# EAGLE design Modular_RFPA_v101 (EAGLE 6.6.0)

## Sheet 1 of 4
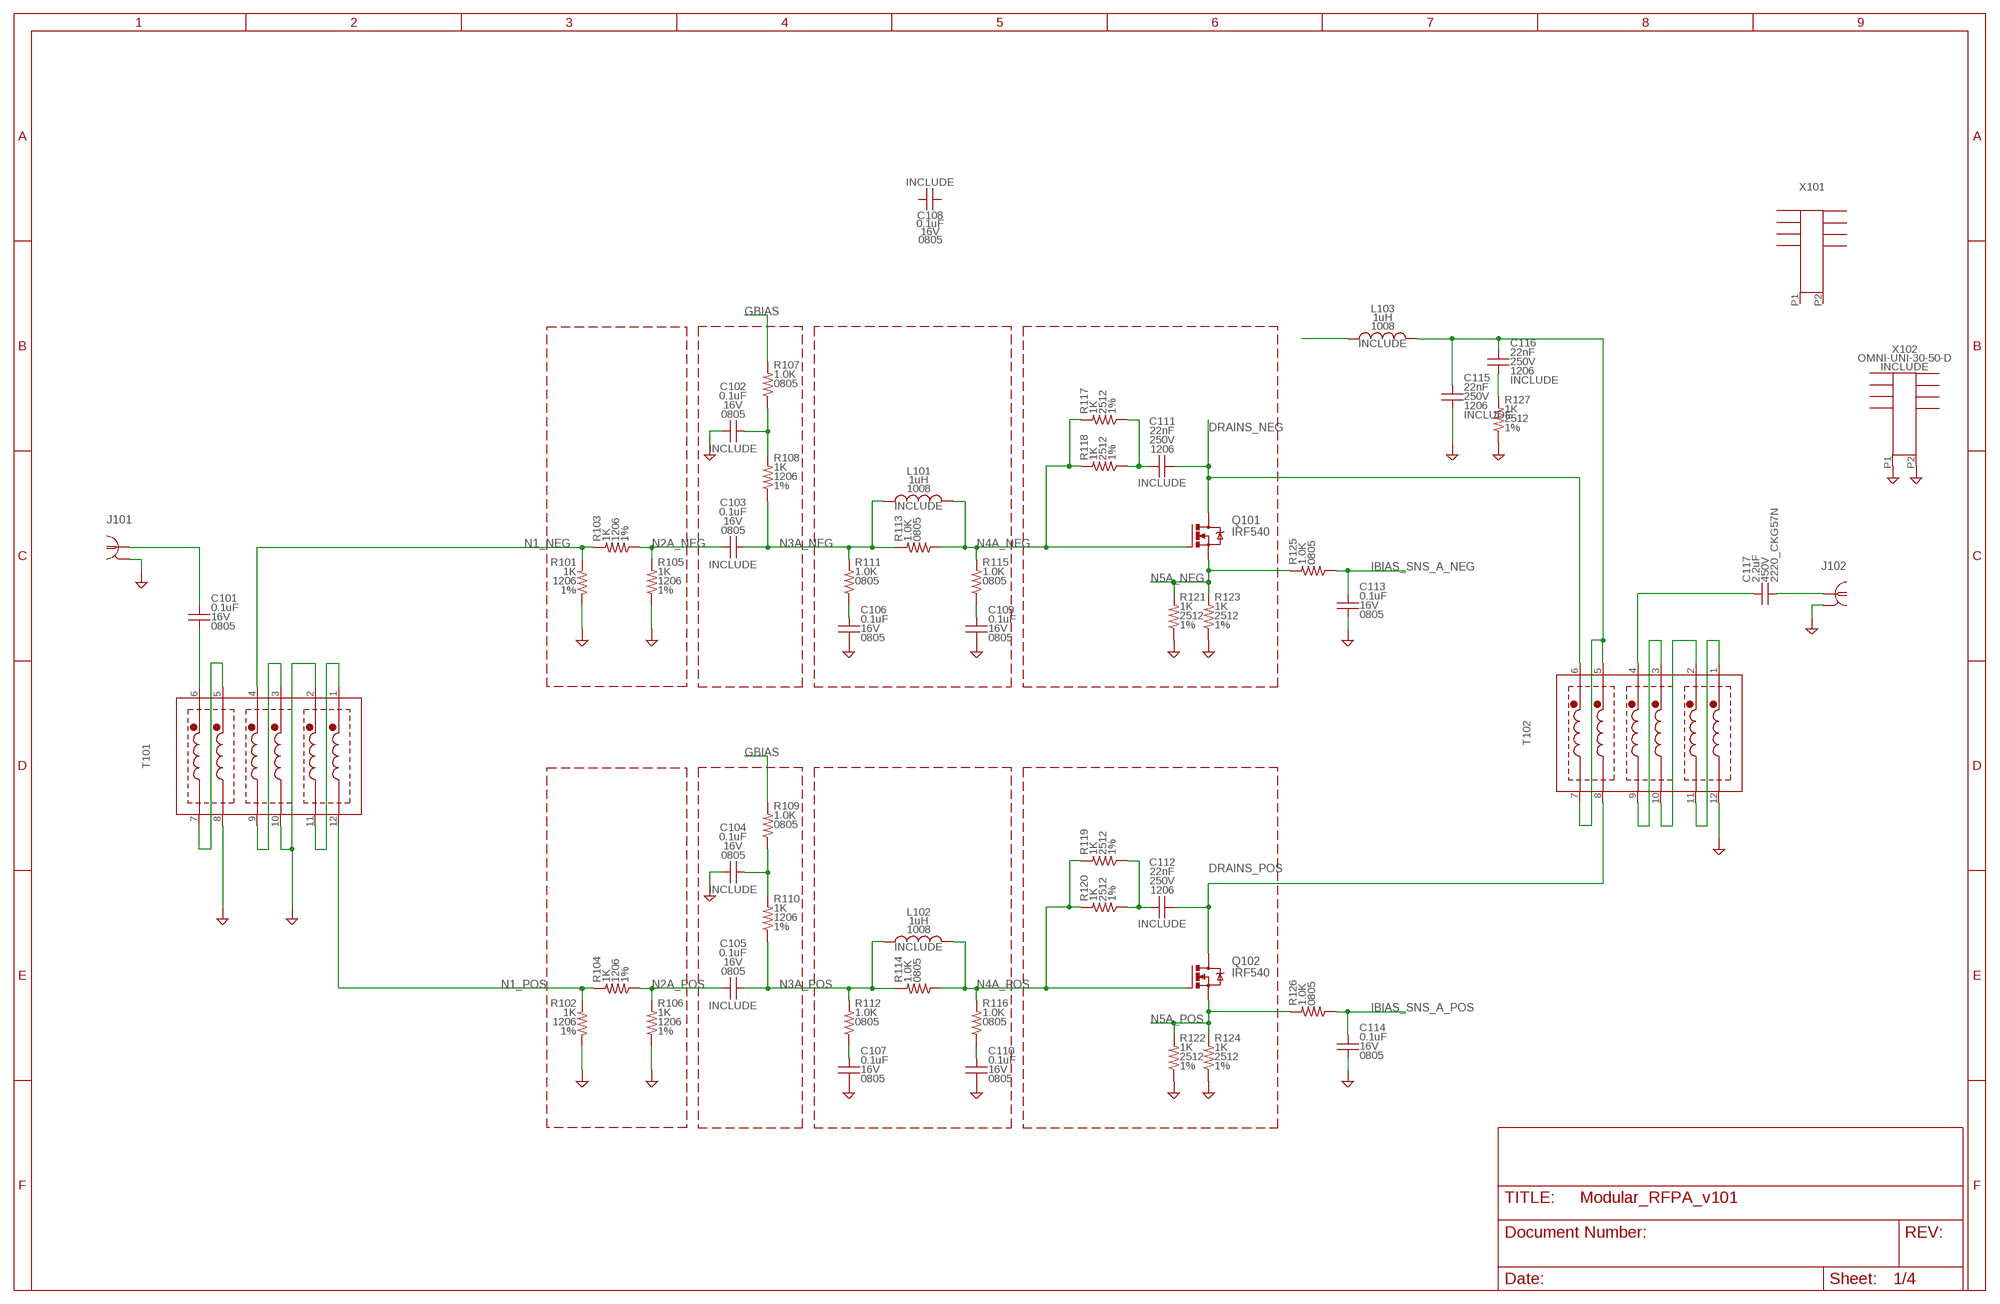
[diagram p0: schematic, sheet 1]

### Parts
C101  0.1uF  CC-0.1U-16V-0805-X7R0805_IPC  [0805_IPC-7351B]
C102  0.1uF  CC-0.1U-16V-0805-X7R0805_IPC  [0805_IPC-7351B]
C103  0.1uF  CC-0.1U-16V-0805-X7R0805_IPC  [0805_IPC-7351B]
C104  0.1uF  CC-0.1U-16V-0805-X7R0805_IPC  [0805_IPC-7351B]
C105  0.1uF  CC-0.1U-16V-0805-X7R0805_IPC  [0805_IPC-7351B]
C106  0.1uF  CC-0.1U-16V-0805-X7R0805_IPC  [0805_IPC-7351B]
C107  0.1uF  CC-0.1U-16V-0805-X7R0805_IPC  [0805_IPC-7351B]
C108  0.1uF  CC-0.1U-16V-0805-X7R0805_IPC  [0805_IPC-7351B]
C109  0.1uF  CC-0.1U-16V-0805-X7R0805_IPC  [0805_IPC-7351B]
C110  0.1uF  CC-0.1U-16V-0805-X7R0805_IPC  [0805_IPC-7351B]
C111  22nF  CC-22N-250V-5%-1206-NP0C1206  [C1206]
C112  22nF  CC-22N-250V-5%-1206-NP0C1206  [C1206]
C113  0.1uF  CC-0.1U-16V-0805-X7R0805_IPC  [0805_IPC-7351B]
C114  0.1uF  CC-0.1U-16V-0805-X7R0805_IPC  [0805_IPC-7351B]
C115  22nF  CC-22N-250V-5%-1206-NP0C1206  [C1206]
C116  22nF  CC-22N-250V-5%-1206-NP0C1206  [C1206]
C117  2.2uF  CC-2.2U-450V-20%-2220-X7TC2220_CKG57N  [C2220_CKG57N]
J101  COAXBNC_EDGE  [BNC_EDGE]
J102  COAXBNC_EDGE  [BNC_EDGE]
L101  1uH  L_CHIPL-1.0U-AIR-5%-1008-0.37A1008  [L1008]
L102  1uH  L_CHIPL-1.0U-AIR-5%-1008-0.37A1008  [L1008]
L103  1uH  L_CHIPL-1.0U-AIR-5%-1008-0.37A1008  [L1008]
Q101  IRF540  [TO220BV]
Q102  IRF540  [TO220BV]
R101  1K  RR-1.0K-1%-1206-0.25WR1206  [R1206]
R102  1K  RR-1.0K-1%-1206-0.25WR1206  [R1206]
R103  1K  RR-1.0K-1%-1206-0.25WR1206  [R1206]
R104  1K  RR-1.0K-1%-1206-0.25WR1206  [R1206]
R105  1K  RR-1.0K-1%-1206-0.25WR1206  [R1206]
R106  1K  RR-1.0K-1%-1206-0.25WR1206  [R1206]
R107  1.0K  RR-1.0K-0.1%-0805-0.1W0805_IPC  [0805_IPC-7351B]
R108  1K  RR-1.0K-1%-1206-0.25WR1206  [R1206]
R109  1.0K  RR-1.0K-0.1%-0805-0.1W0805_IPC  [0805_IPC-7351B]
R110  1K  RR-1.0K-1%-1206-0.25WR1206  [R1206]
R111  1.0K  RR-1.0K-0.1%-0805-0.1W0805_IPC  [0805_IPC-7351B]
R112  1.0K  RR-1.0K-0.1%-0805-0.1W0805_IPC  [0805_IPC-7351B]
R113  1.0K  RR-1.0K-0.1%-0805-0.1W0805_IPC  [0805_IPC-7351B]
R114  1.0K  RR-1.0K-0.1%-0805-0.1W0805_IPC  [0805_IPC-7351B]
R115  1.0K  RR-1.0K-0.1%-0805-0.1W0805_IPC  [0805_IPC-7351B]
R116  1.0K  RR-1.0K-0.1%-0805-0.1W0805_IPC  [0805_IPC-7351B]
R117  1K  RR-1K-1%-2512-1WR2512  [R2512]
R118  1K  RR-1K-1%-2512-1WR2512  [R2512]
R119  1K  RR-1K-1%-2512-1WR2512  [R2512]
R120  1K  RR-1K-1%-2512-1WR2512  [R2512]
R121  1K  RR-1K-1%-2512-1WR2512  [R2512]
R122  1K  RR-1K-1%-2512-1WR2512  [R2512]
R123  1K  RR-1K-1%-2512-1WR2512  [R2512]
R124  1K  RR-1K-1%-2512-1WR2512  [R2512]
R125  1.0K  RR-1.0K-0.1%-0805-0.1W0805_IPC  [0805_IPC-7351B]
R126  1.0K  RR-1.0K-0.1%-0805-0.1W0805_IPC  [0805_IPC-7351B]
R127  1K  RR-1K-1%-2512-1WR2512  [R2512]
T101  HP5_TRAFOHP5  [HP5]
T102  HP5_TRAFOHP5  [HP5]
X101  HEATSINK_OMNI_DUAL30-75-D  [OMNI-UNI-30-75-D]
X102  HEATSINK_OMNI_DUALOMNI-UNI-30-50-DUNI-30-50-D  [OMNI-UNI-30-50-D]

### Nets
DRAINS_NEG: C111.2 Q101.D T102.6(S6)
DRAINS_POS: C112.2 Q102.D T102.8(F5)
GBIAS: R107.1 R109.1 ; also sheet 3
GND: C102.2 C104.2 C106.2 C107.2 C109.2 C110.2 C113.2 C114.2 C115.2 J101.G1(GND1) J101.G2(GND1) J101.G3(GND1) J101.G4(GND1) J102.G1(GND1) J102.G2(GND1) J102.G3(GND1) J102.G4(GND1) R101.2 R102.2 R105.2 R106.2 R121.2 R122.2 R123.2 R124.2 R127.2 T101.2(S2) T101.8(F5) T101.10(F3) T102.12(F1) X102.P1 X102.P2 ; also sheet 3,4
IBIAS_SNS_A_NEG: C113.1 R125.2
IBIAS_SNS_A_POS: C114.1 R126.2
N1_NEG: R101.1 R103.1 T101.4(S4)
N1_POS: R102.1 R104.1 T101.12(F1)
N2A_NEG: C103.2 R103.2 R105.1
N2A_POS: C105.2 R104.2 R106.1
N3A_NEG: C103.1 L101.1 R108.2 R111.1 R113.1
N3A_POS: C105.1 L102.1 R110.2 R112.1 R114.1
N4A_NEG: L101.2 Q101.G R113.2 R115.1 R117.1 R118.1
N4A_POS: L102.2 Q102.G R114.2 R116.1 R119.1 R120.1
N5A_NEG: Q101.S R121.1 R123.1 R125.1
N5A_POS: Q102.S R122.1 R124.1 R126.1
N$4: C111.1 R117.2 R118.2
N$5: C106.1 R111.2
N$8: C104.1 R109.2 R110.1
N$10: C107.1 R112.2
N$11: C110.1 R116.2
N$12: C112.1 R119.2 R120.2
N$13: C102.1 R107.2 R108.1
N$17: C109.1 R115.2
N$22: L103.1
N$27: T102.3(S3) T102.9(F4)
N$28: T102.2(S2) T102.10(F3)
N$29: T102.1(S1) T102.11(F2)
N$30: T101.3(S3) T101.9(F4)
N$31: C117.2 J102.C
N$32: C117.1 T102.4(S4)
N$33: T101.1(S1) T101.11(F2)
N$34: C101.1 J101.C
N$37: C116.2 R127.1
N$41: C101.2 T101.6(S6)
VB_CT: C115.1 C116.1 L103.2 T102.5(S5) T102.7(F6)
VB_CT1: T101.5(S5) T101.7(F6)
Unconnected: C108.1 C108.2 X101.P1 X101.P2

## Sheet 2 of 4

## Sheet 3 of 4
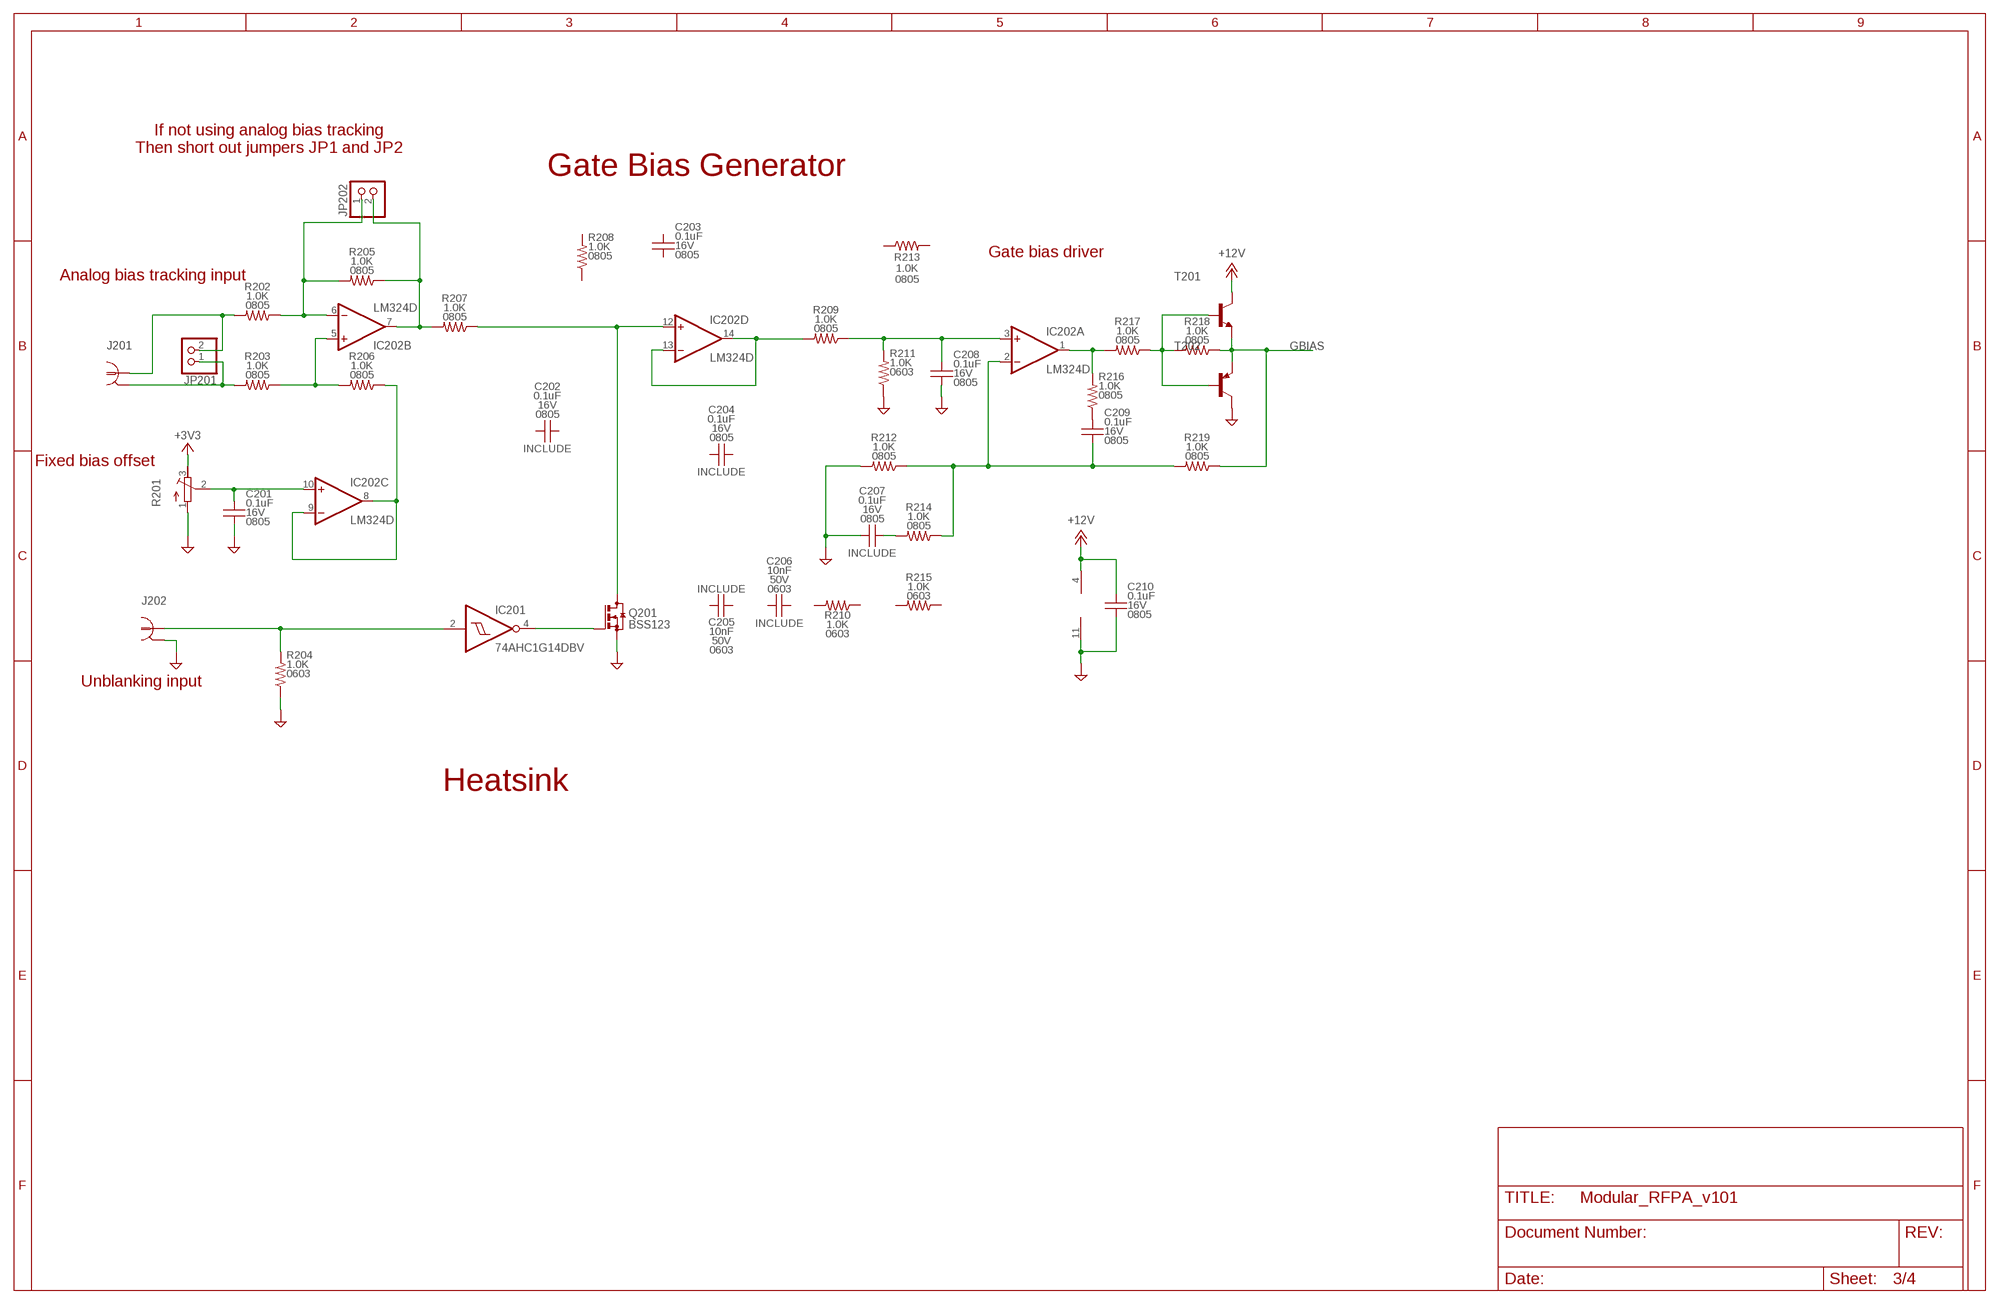
[diagram p1: schematic, sheet 3]

### Parts
C201  0.1uF  CC-0.1U-16V-0805-X7R0805_IPC  [0805_IPC-7351B]
C202  0.1uF  CC-0.1U-16V-0805-X7R0805_IPC  [0805_IPC-7351B]
C203  0.1uF  CC-0.1U-16V-0805-X7R0805_IPC  [0805_IPC-7351B]
C204  0.1uF  CC-0.1U-16V-0805-X7R0805_IPC  [0805_IPC-7351B]
C205  10nF  CC-10N-50V-0603-NP00603_IPC  [0603_IPC-7351B]
C206  10nF  CC-10N-50V-0603-NP00603_IPC  [0603_IPC-7351B]
C207  0.1uF  CC-0.1U-16V-0805-X7R0805_IPC  [0805_IPC-7351B]
C208  0.1uF  CC-0.1U-16V-0805-X7R0805_IPC  [0805_IPC-7351B]
C209  0.1uF  CC-0.1U-16V-0805-X7R0805_IPC  [0805_IPC-7351B]
C210  0.1uF  CC-0.1U-16V-0805-X7R0805_IPC  [0805_IPC-7351B]
IC201  74AHC1G14DBV  [SOT23-5]
IC202  LM324D  [SO14]
J201  COAXBNC_EDGE  [BNC_EDGE]
J202  COAXBNC_EDGE  [BNC_EDGE]
JP201  PINHD-1X2  [1X02]
JP202  PINHD-1X2  [1X02]
Q201  BSS123  [SOT23]
R201  R-TRIMM3299W  [RTRIM3299W]
R202  1.0K  RR-1.0K-0.1%-0805-0.1W0805_IPC  [0805_IPC-7351B]
R203  1.0K  RR-1.0K-0.1%-0805-0.1W0805_IPC  [0805_IPC-7351B]
R204  1.0K  RR-1.0K-0.1%-0603-0.1W0603_IPC  [0603_IPC-7351B]
R205  1.0K  RR-1.0K-0.1%-0805-0.1W0805_IPC  [0805_IPC-7351B]
R206  1.0K  RR-1.0K-0.1%-0805-0.1W0805_IPC  [0805_IPC-7351B]
R207  1.0K  RR-1.0K-0.1%-0805-0.1W0805_IPC  [0805_IPC-7351B]
R208  1.0K  RR-1.0K-0.1%-0805-0.1W0805_IPC  [0805_IPC-7351B]
R209  1.0K  RR-1.0K-0.1%-0805-0.1W0805_IPC  [0805_IPC-7351B]
R210  1.0K  RR-1.0K-0.1%-0603-0.1W0603_IPC  [0603_IPC-7351B]
R211  1.0K  RR-1.0K-0.1%-0603-0.1W0603_IPC  [0603_IPC-7351B]
R212  1.0K  RR-1.0K-0.1%-0805-0.1W0805_IPC  [0805_IPC-7351B]
R213  1.0K  RR-1.0K-0.1%-0805-0.1W0805_IPC  [0805_IPC-7351B]
R214  1.0K  RR-1.0K-0.1%-0805-0.1W0805_IPC  [0805_IPC-7351B]
R215  1.0K  RR-1.0K-0.1%-0603-0.1W0603_IPC  [0603_IPC-7351B]
R216  1.0K  RR-1.0K-0.1%-0805-0.1W0805_IPC  [0805_IPC-7351B]
R217  1.0K  RR-1.0K-0.1%-0805-0.1W0805_IPC  [0805_IPC-7351B]
R218  1.0K  RR-1.0K-0.1%-0805-0.1W0805_IPC  [0805_IPC-7351B]
R219  1.0K  RR-1.0K-0.1%-0805-0.1W0805_IPC  [0805_IPC-7351B]
T201  BC808-NPN-SOT23-BEC  [SOT23-BEC]
T202  BC807-16-PNP-SOT23-BEC  [SOT23-BEC]

### Nets
+3V3: R201.3(E)
+12V: C210.1 IC202.4(P:V+) T201.C ; also sheet 4
GBIAS: R218.2 R219.2 T201.E T202.E ; also sheet 1
GND: C201.2 C207.2 C208.2 C210.2 IC202.11(P:V-) J202.G1(GND1) J202.G2(GND1) J202.G3(GND1) J202.G4(GND1) Q201.2(S) R201.1(A) R204.2 R211.2 R212.1 T202.C ; also sheet 1,4
N$1: IC202.1(A:OUT) R216.1 R217.1
N$2: R217.2 R218.1 T201.B T202.B
N$3: IC201.2(I) J202.C R204.1
N$6: IC202.13(D:-IN) IC202.14(D:OUT) R209.1
N$7: C209.1 R216.2
N$9: C207.1 R214.1
N$14: C209.2 IC202.2(A:-IN) R212.2 R214.2 R219.1
N$15: C208.1 IC202.3(A:+IN) R209.2 R211.1
N$16: IC202.5(B:+IN) R203.2 R206.1
N$18: IC202.7(B:OUT) JP202.2 R205.2 R207.1
N$19: IC202.6(B:-IN) JP202.1 R202.2 R205.1
N$20: J201.C JP201.2 R202.1
N$21: J201.G1(GND1) J201.G2(GND1) J201.G3(GND1) J201.G4(GND1) JP201.1 R203.1
N$23: IC202.12(D:+IN) Q201.3(D) R207.2
N$24: IC201.4(O) Q201.1(G)
N$25: C201.1 IC202.10(C:+IN) R201.2(S)
N$26: IC202.8(C:OUT) IC202.9(C:-IN) R206.2
Unconnected: C202.1 C202.2 C203.1 C203.2 C204.1 C204.2 C205.1 C205.2 C206.1 C206.2 R208.1 R208.2 R210.1 R210.2 R213.1 R213.2 R215.1 R215.2

### Notes on the sheet
- If not using analog bias tracking
  Then short out jumpers JP1 and JP2
- Gate Bias Generator
- Gate bias driver
- Analog bias tracking input
- Fixed bias offset
- Unblanking input
- Heatsink

## Sheet 4 of 4: Power entry
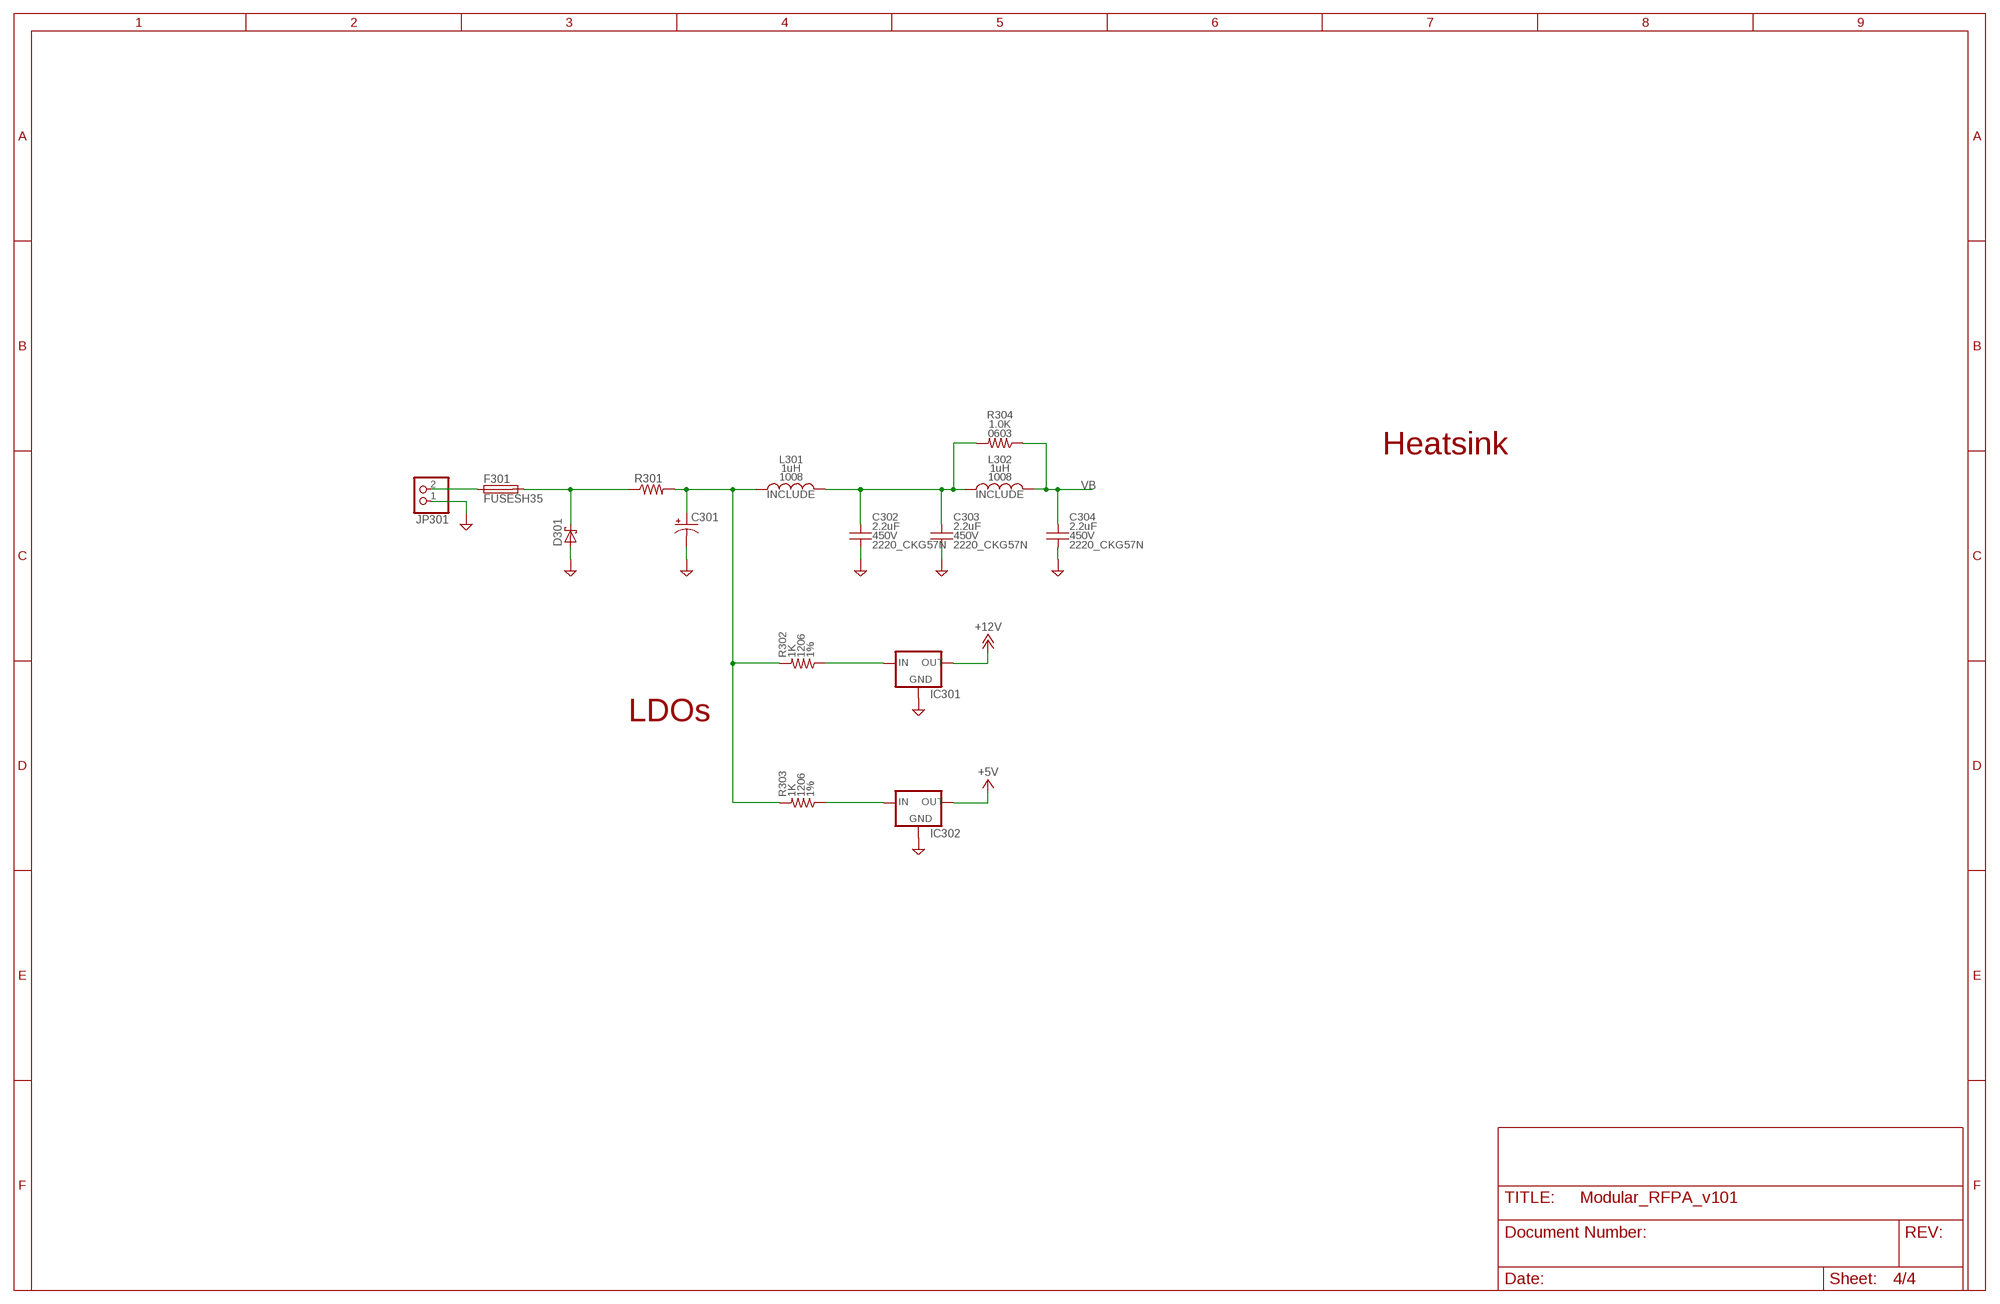
[diagram p2: schematic, sheet 4]

### Parts
C301  CPOL-USE10-25  [EB25D]
C302  2.2uF  CC-2.2U-450V-20%-2220-X7TC2220_CKG57N  [C2220_CKG57N]
C303  2.2uF  CC-2.2U-450V-20%-2220-X7TC2220_CKG57N  [C2220_CKG57N]
C304  2.2uF  CC-2.2U-450V-20%-2220-X7TC2220_CKG57N  [C2220_CKG57N]
D301  SCHOTTKY-DIODESMC  [SMC]
F301  FUSESH35  [SH25]
IC301  78XXS  [78XXS]
IC302  78XXS  [78XXS]
JP301  PINHD-1X2  [1X02]
L301  1uH  L_CHIPL-1.0U-AIR-5%-1008-0.37A1008  [L1008]
L302  1uH  L_CHIPL-1.0U-AIR-5%-1008-0.37A1008  [L1008]
R301  R-US_0617/22  [0617/22]
R302  1K  RR-1.0K-1%-1206-0.25WR1206  [R1206]
R303  1K  RR-1.0K-1%-1206-0.25WR1206  [R1206]
R304  1.0K  RR-1.0K-0.1%-0603-0.1W0603_IPC  [0603_IPC-7351B]

### Nets
+5V: IC302.OUT
+12V: IC301.OUT ; also sheet 3
GND: C301.- C302.2 C303.2 C304.2 D301.A IC301.GND IC302.GND JP301.1 ; also sheet 1,3
N$43: IC301.IN R302.2
N$44: D301.C F301.2 R301.1
N$45: F301.1 JP301.2
N$46: C301.+ L301.1 R301.2 R302.1 R303.1
N$47: C302.1 C303.1 L301.2 L302.1 R304.1
N$49: IC302.IN R303.2
VB: C304.1 L302.2 R304.2

### Notes on the sheet
- Heatsink
- LDOs

## Power pins joined to a net without a drawn wire
GND: IC201.3(GND)
VCC: IC201.5(VCC)

## Library data of the parts
C101 C106 C107 C109 C110 C113 C114 C201 C203 C208-C210 = MDT_C:C; PACKAGE: 0805; VOLTAGE: 16V
C102-C105 C108 C202 C204 C207 = MDT_C:C; BOM: INCLUDE; PACKAGE: 0805; VOLTAGE: 16V
C111 C112 C115 C116 = MDT_C:C; BOM: INCLUDE; DIALECTRIC: NP0; PACKAGE: 1206; PARTNO: C3216NP02E223J160AA; TOL: 5; VOLTAGE: 250V
C117 C302-C304 = MDT_C:C; DIALECTRIC: X7T; PACKAGE: 2220_CKG57N; PARTNO: CKG57NX7T2W225M500JJ; TOL: 20%; VOLTAGE: 450V
C205 C206 = MDT_C:C; BOM: INCLUDE; DIALECTRIC: NP0; PACKAGE: 0603; PARTNO: C1608C0G1H103J080AA; TOL: 5; VOLTAGE: 50V
C301 = rcl:CPOL-US: POLARIZED CAPACITOR, American symbol
D301 = diode:SCHOTTKY-DIODE: Schottky Diode
F301 = fuse:FUSE: Fuse; OC_FARNELL: unknown; OC_NEWARK: unknown
IC201 = 74xx-little-us:74*1G14: Single Schmitt-Trigger Inverter Gate
IC202 = linear:LM324: OP AMP
IC301 IC302 = v-reg:78XXS: VOLTAGE REGULATOR
J101 J102 J201 J202 = MDT_CON:COAX
JP201 JP202 JP301 = pinhead:PINHD-1X2: PIN HEADER
L101-L103 L301 L302 = MDT_L:L_CHIP; BOM: INCLUDE; CORE: AIR; DCR: 1.8; IDC: 0.37A; PACKAGE: 1008; PARTNO: 1008CS-102XJEC; TOL: 5%
Q101 Q102 = transistor-power:IRF540: HEXFET Power MOSFET
Q201 = transistor-small-signal:BSS123: N-CHANNEL MOS FET
R101-R106 R108 R110 R302 R303 = MDT_R:R; PACKAGE: 1206; POWER: 0.25; TOL: 1%
R107 R109 R111-R116 R125 R126 R202 R203 R205-R209 R212-R214 R216-R219 = MDT_R:R; PACKAGE: 0805
R117-R124 R127 = MDT_R:R; PACKAGE: 2512; POWER: 1; TOL: 1%
R201 = rcl:R-TRIMM: Trimm resistor
R204 R210 R211 R215 R304 = MDT_R:R; PACKAGE: 0603
R301 = resistor:R-US_: RESISTOR, American symbol
T101 T102 = MDT_TRAFO:HP5_TRAFO
T201 = transistor:*-NPN-: NPN Transistror BF959 corrected 2008.03.06
T202 = transistor:*-PNP-: PNP Transistror
X101 = MDT_HEATSINK:HEATSINK_OMNI_DUAL
X102 = MDT_HEATSINK:HEATSINK_OMNI_DUAL; BOM: INCLUDE; PARTNO: OMNI-UNI-30-50-D

## Board
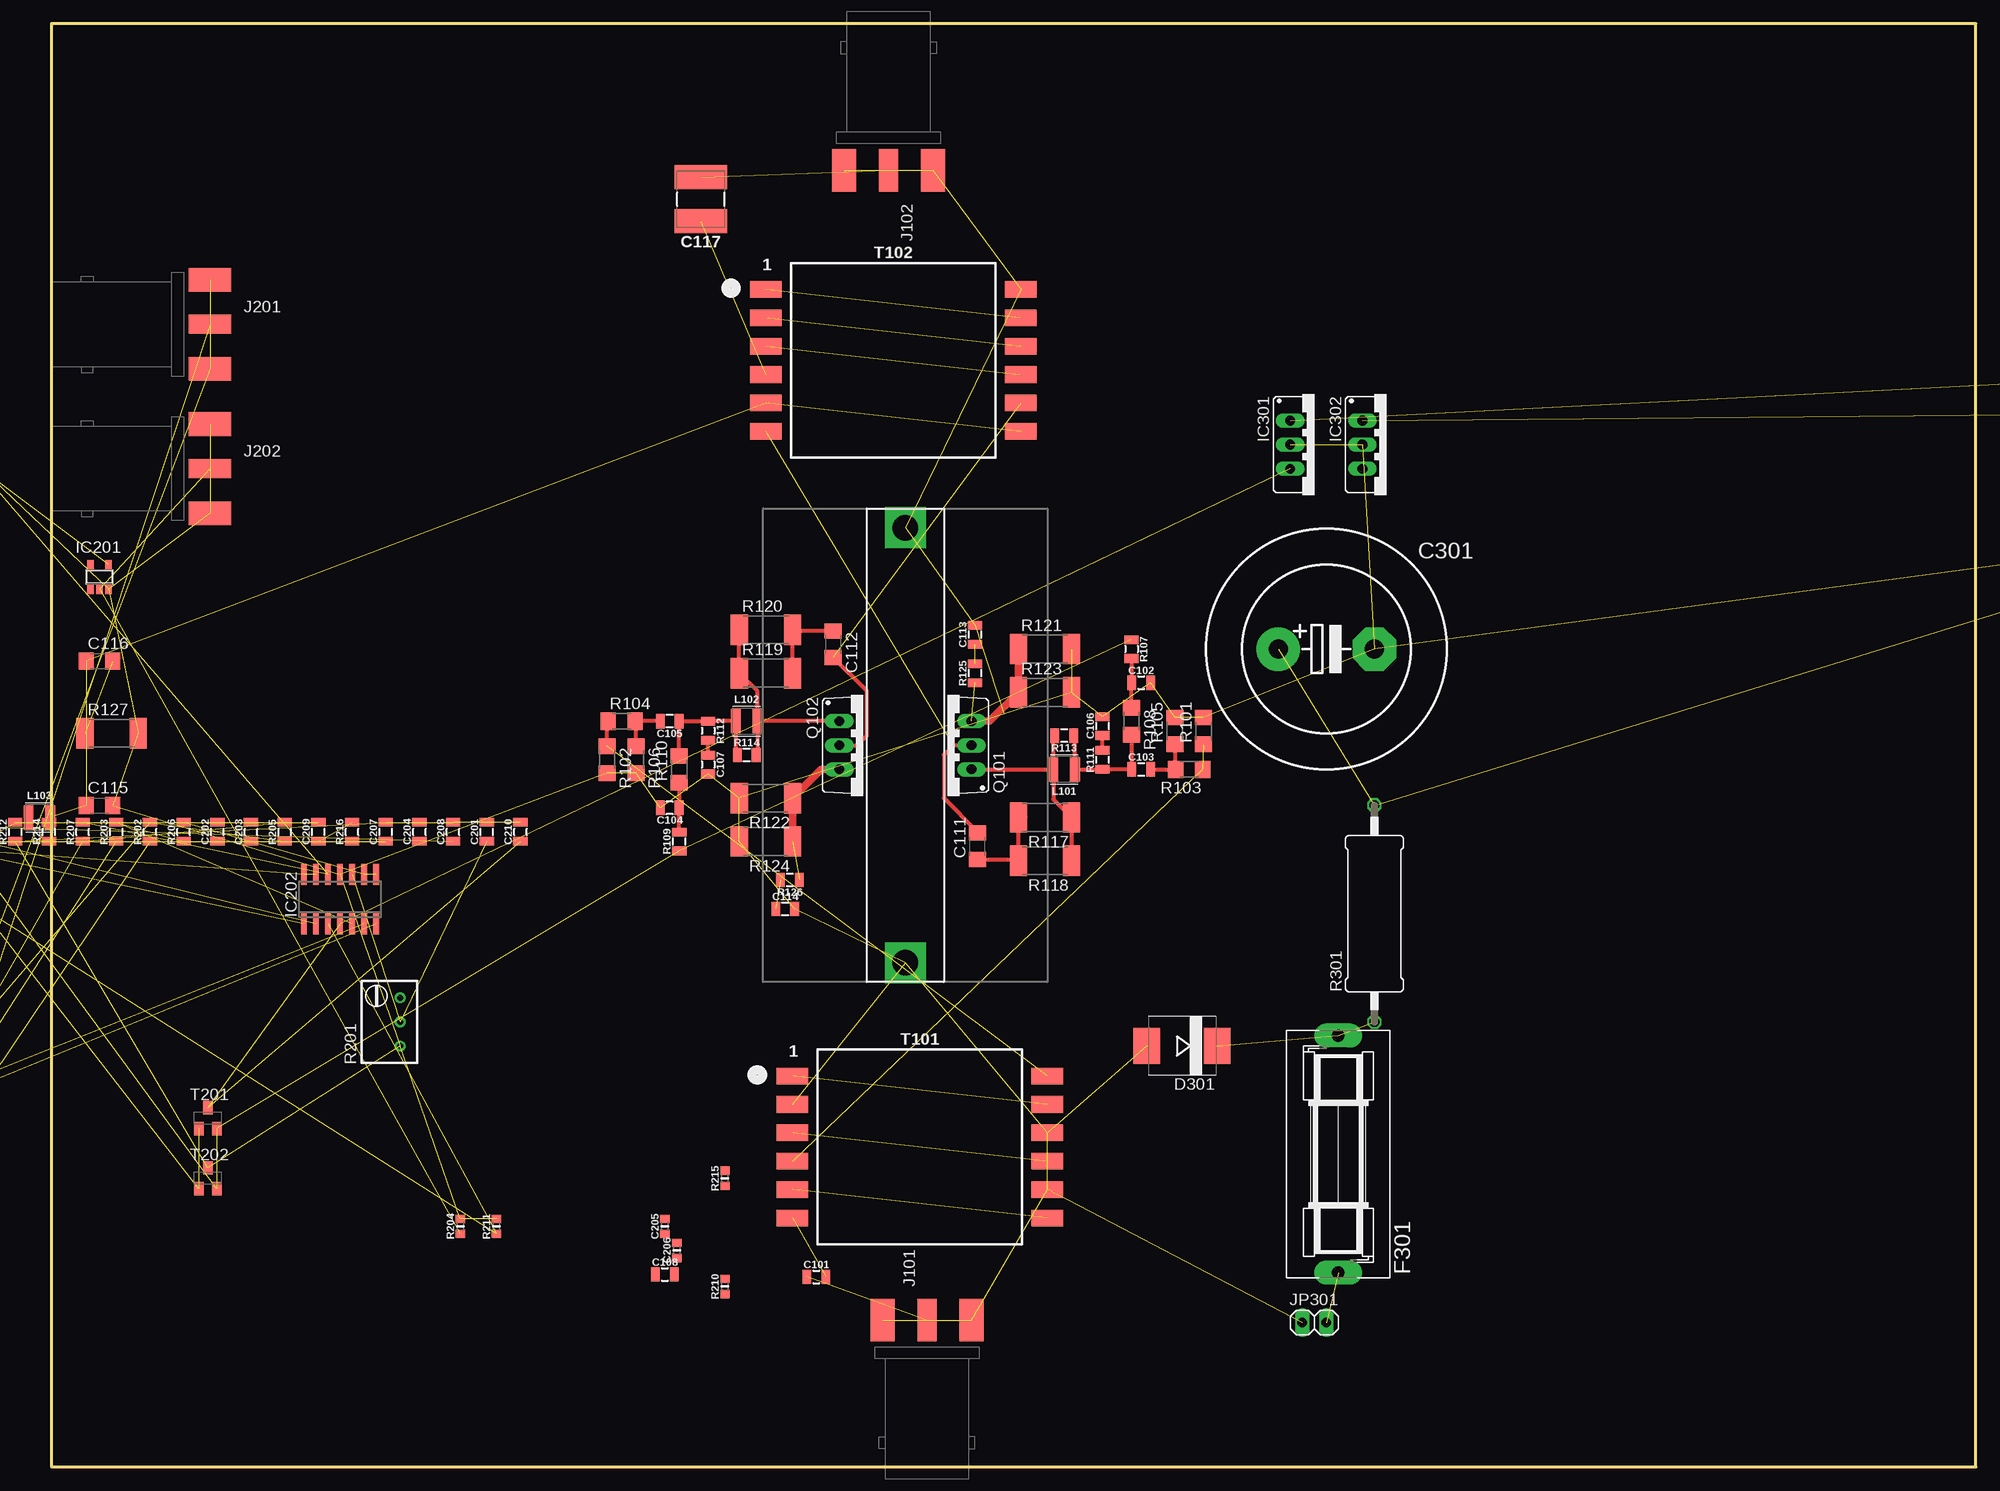
[diagram p3: board, top side]
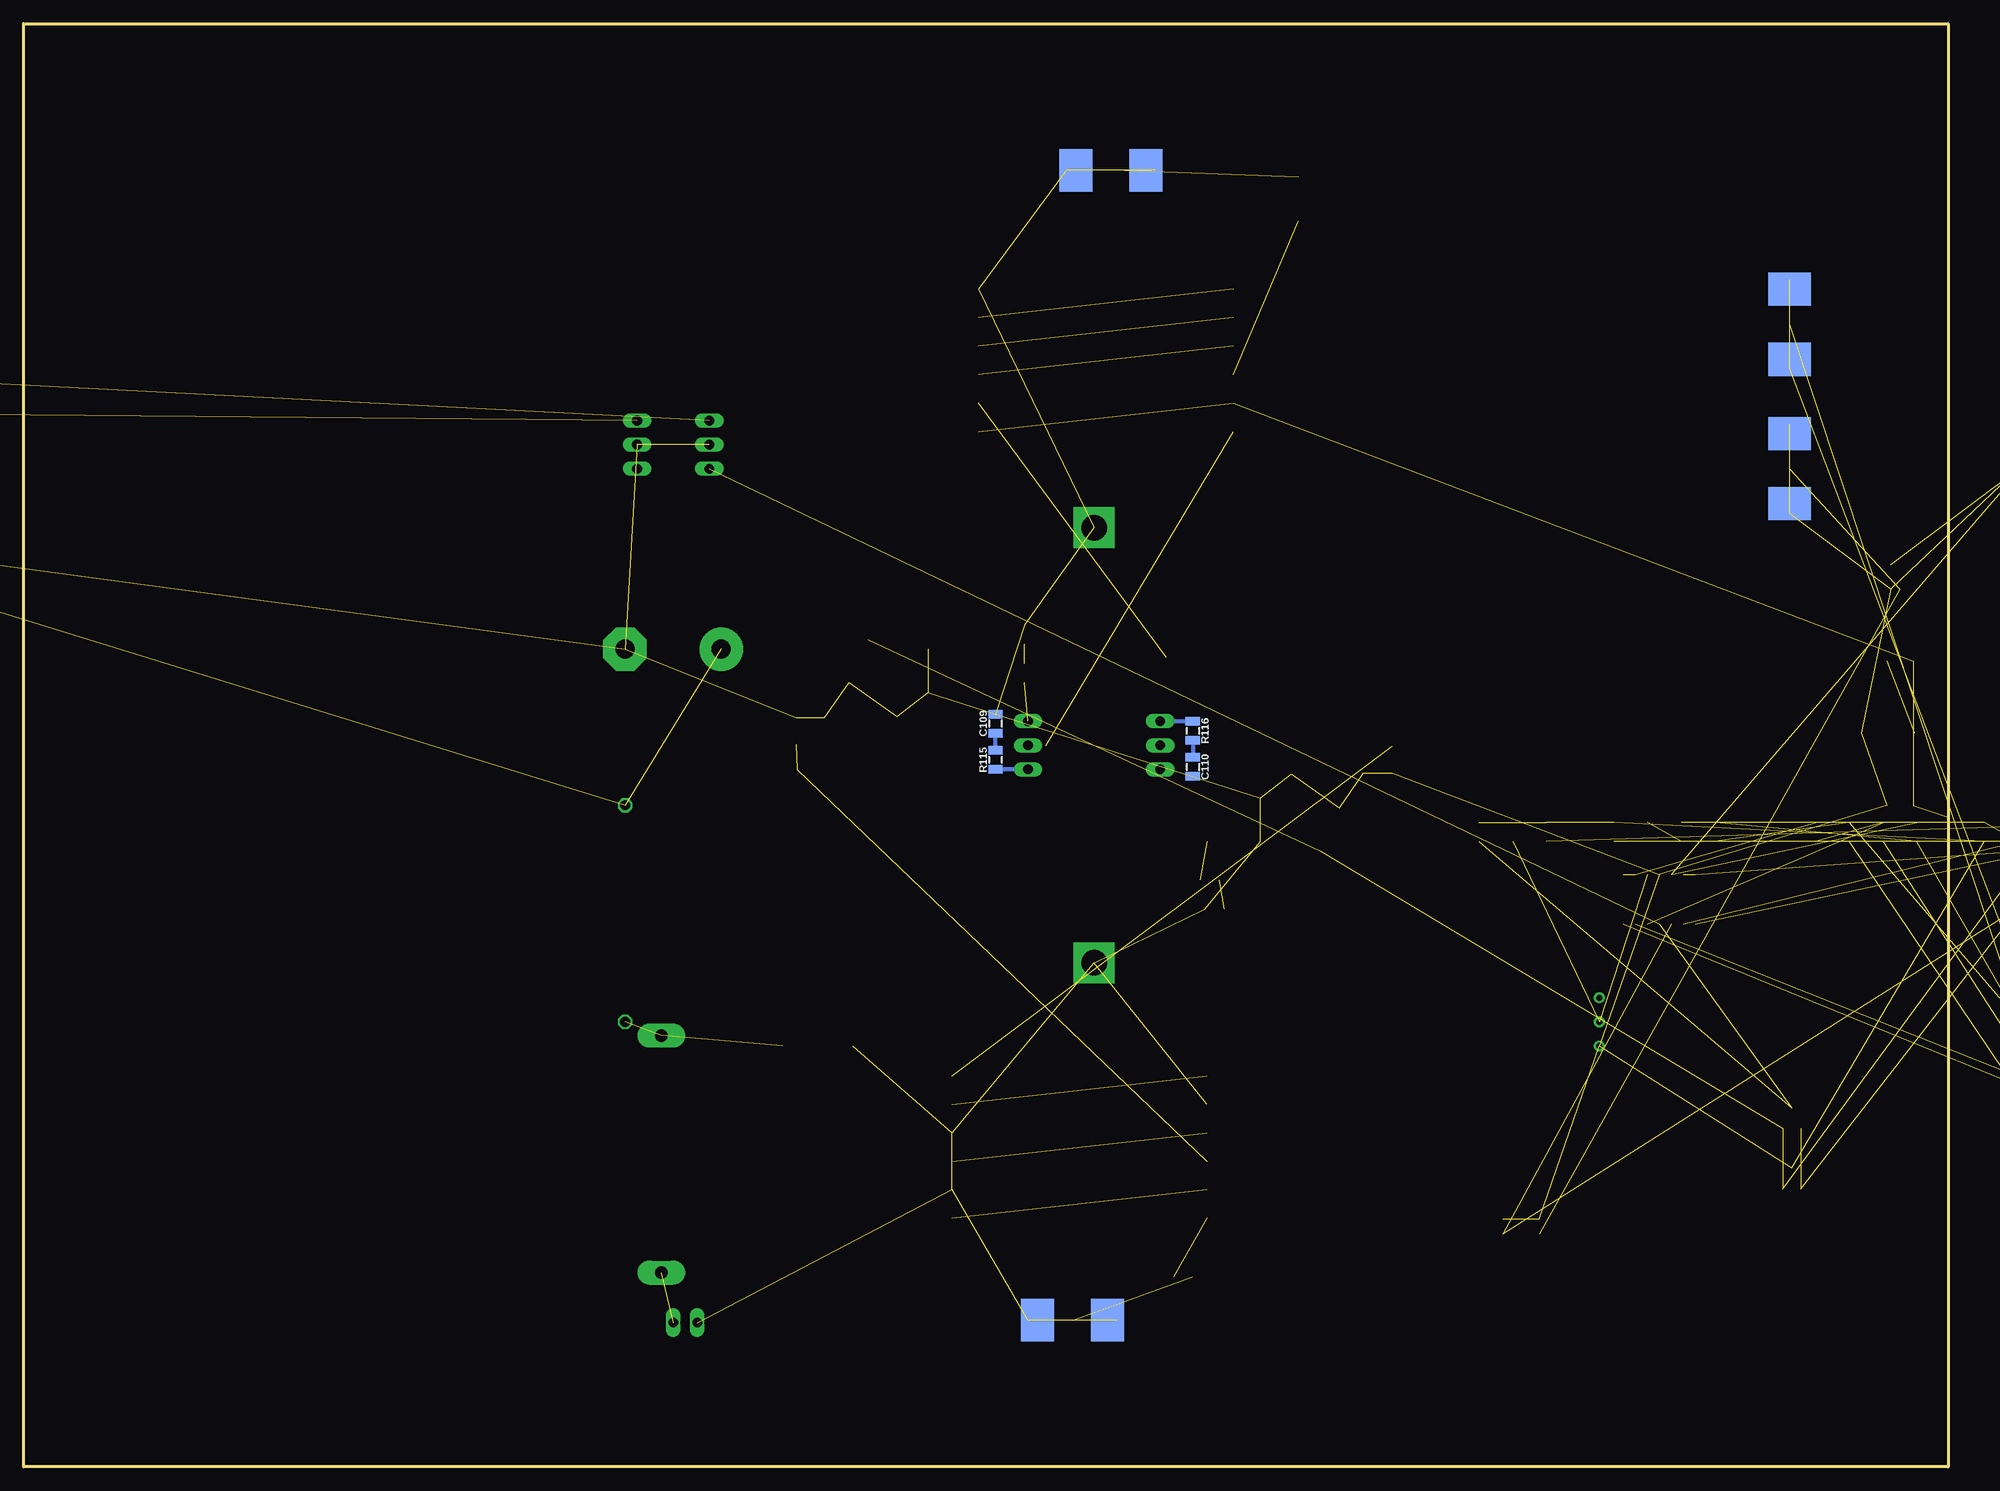
[diagram p4: board, bottom side, seen from below]

Size 203.2 x 152.4 mm. Coordinates in mm from the lower left corner, seen from the top.
Outline: 0,0 203.2,0 203.2,152.4 0,152.4 0,0
Copper layers (1+2*15+16): Top 0.035mm / dielectric 1.5mm / Route2 0.035mm / dielectric 0.15mm / Route15 0.035mm / dielectric 0.2mm / Bottom 0.035mm
Design rules "default *": minimum track width 10mil, minimum drill 24mil, track to track 8mil, track to pad 8mil, pad to pad 8mil, via to via 8mil, smd to smd 8mil, copper to edge 40mil, drill to drill 8mil, minimum pad ring 10mil, minimum via ring 8mil, stop-mask expansion 4mil, vias tented up to drill 0mil, thermal gap 10mil

### Footprints (pad centres in the part's own frame; a part is rotated, then mirrored left to right if it is on the bottom)
0805_IPC-7351B = smd 0.9 x 1.5: 1 -1,0; 2 1,0
C1206 = smd 1.6 x 1.8: 1 -1.4,0; 2 1.4,0
C2220_CKG57N = smd 2.53 x 5.51: 1 -2.335,0; 2 2.335,0
0603_IPC-7351B = smd 0.87 x 0.97: 1 -0.8,0; 2 0.8,0
EB25D = drill 2.007 pad 4.597: + -5.08,0 | drill 2.007 pad 4.597 octagon: - 5.08,0
SMC = smd 2.8 x 3.8: A 3.7,0; C -3.7,0
SH25 = drill 1.321 pad 2.54 long: 1 -12.522,0; 2 12.522,0
SOT23-5 = smd 0.69 x 0.99: 1 -0.95,-1.29; 2 0,-1.29; 3 0.95,-1.29; 4 0.95,1.3; 5 -0.95,1.3
SO14 = smd 0.6 x 2.2: 1 -3.81,-2.6; 2 -2.54,-2.6; 3 -1.27,-2.6; 4 0,-2.6; 5 1.27,-2.6; 6 2.54,-2.6; 7 3.81,-2.6; 8 3.81,2.6; 9 2.54,2.6; 10 1.27,2.6; 11 0,2.6; 12 -1.27,2.6; 13 -2.54,2.6; 14 -3.81,2.6
78XXS = drill 1.016 long: GND 0,-2.54; IN -2.54,-2.54; OUT 2.54,-2.54
BNC_EDGE = smd 4.5 x 2: C 0.25,0 | smd 4.5 x 2.5: G1 0.25,4.7; G4 0.25,-4.7 | smd 4.5 x 3.5 bottom: G2 0.25,3.7; G3 0.25,-3.7
1X02 = drill 1.016 long: 1 -1.27,0; 2 1.27,0
L1008 = smd 1.02 x 2.54: 1 -1.145,0; 2 1.145,0
TO220BV = drill 1.016 long: D 0,-2.54; G -2.54,-2.54; S 2.54,-2.54
SOT23 = smd 1 x 1.4: 1 -0.95,-1.1; 2 0.95,-1.1; 3 0,1.1
R1206 = smd 1.6 x 1.803: 1 -1.422,0; 2 1.422,0
R2512 = smd 1.8 x 3.2: 1 -2.8,0; 2 2.8,0
RTRIM3299W = drill 0.61: 1 1.27,-2.54; 2 1.27,0; 3 1.27,2.54
0617/22 = drill 1.016 octagon: 1 -11.43,0; 2 11.43,0
HP5 = smd 3.3 x 1.75: 1 -13.46,7.5; 2 -13.46,4.5; 3 -13.46,1.5; 4 -13.46,-1.5; 5 -13.46,-4.5; 6 -13.46,-7.5; 7 13.46,-7.5; 8 13.46,-4.5; 9 13.46,-1.5; 10 13.46,1.5; 11 13.46,4.5; 12 13.46,7.5
SOT23-BEC = smd 1 x 1.4: B -0.95,-1.1; C 0,1.1; E 0.95,-1.1
OMNI-UNI-30-75-D = drill 2.667 pad 4.318 square: P1 0,35.47; P2 0,-35.47
OMNI-UNI-30-50-D = drill 2.667 pad 4.318 square: P1 0,22.97; P2 0,-22.97

### Placement (x,y rotation side)
C101  80.77,20.07 0 top
C102  115.06,82.8 0 top
C103  115.06,73.66 0 top
C104  65.28,69.6 180 top
C105  65.28,78.74 180 top
C106  111,78.23 90 top
C107  69.34,74.17 270 top
C108  64.77,20.32 0 top
C109  100.58,78.49 90 bottom
C110  79.76,73.91 270 bottom
C111  97.79,65.53 90 top
C112  82.55,86.87 270 top
C113  97.54,87.88 90 top
C114  77.47,58.93 0 top
C115  5.08,69.85 0 top
C116  5.08,85.09 0 top
C117  68.58,133.86 90 top
C201  45.97,67.06 90 top
C202  17.53,67.06 90 top
C203  21.08,67.06 90 top
C204  38.86,67.06 90 top
C205  64.77,25.4 90 top
C206  66.04,22.86 90 top
C207  35.31,67.06 90 top
C208  42.42,67.06 90 top
C209  28.19,67.06 90 top
C210  49.53,67.06 90 top
C301  134.62,86.36 0 top
C302  279.4,105.41 0 top  (outside the outline)
C303  279.4,140.97 0 top  (outside the outline)
C304  279.4,133.35 0 top  (outside the outline)
D301  119.38,44.45 180 top
F301  135.89,33.02 90 top
IC201  5.08,93.98 0 top
IC202  30.48,59.94 0 top
IC301  133.35,107.95 270 top
IC302  140.97,107.95 270 top
J101  92.46,15.24 90 top
J102  88.39,137.16 270 top
J201  16.51,120.65 0 top
J202  16.51,105.41 0 top
JP201  -13.97,31.75 0 top  (outside the outline)
JP202  -13.97,38.1 0 top  (outside the outline)
JP301  133.35,15.24 0 top
L101  106.93,73.66 180 top
L102  73.41,78.74 0 top
L103  -1.27,68.58 0 top
L301  281.94,153.67 0 top  (outside the outline)
L302  275.59,153.67 0 top  (outside the outline)
Q101  94.62,76.2 90 top
Q102  85.72,76.2 270 top
Q201  -15.24,113.03 0 top  (outside the outline)
R101  121.67,77.72 90 top
R102  58.67,74.68 270 top
R103  120.14,73.66 180 top
R104  60.2,78.74 0 top
R105  118.62,77.72 90 top
R106  61.72,74.68 270 top
R107  114.05,86.36 270 top
R108  114.05,78.74 270 top
R109  66.29,66.04 90 top
R110  66.29,73.66 90 top
R111  111,74.68 90 top
R112  69.34,77.72 270 top
R113  106.93,77.22 180 top
R114  73.41,75.18 0 top
R115  100.58,74.68 90 bottom
R116  79.76,77.72 270 bottom
R117  104.9,68.58 180 top
R118  104.9,64.01 180 top
R119  75.44,83.82 0 top
R120  75.44,88.39 0 top
R121  104.9,86.36 0 top
R122  75.44,70.61 180 top
R123  104.9,81.79 0 top
R124  75.44,66.04 180 top
R125  97.54,83.82 90 top
R126  77.98,61.98 180 top
R127  6.35,77.47 0 top
R201  35.56,46.99 0 top
R202  10.41,67.06 90 top
R203  6.86,67.06 90 top
R204  43.18,25.4 90 top
R205  24.64,67.06 90 top
R206  13.97,67.06 90 top
R207  3.3,67.06 90 top
R208  -25.15,67.06 90 top  (outside the outline)
R209  -21.59,67.06 90 top  (outside the outline)
R210  71.12,19.05 90 top
R211  46.99,25.4 90 top
R212  -3.81,67.06 90 top  (outside the outline)
R213  -18.03,67.06 90 top  (outside the outline)
R214  -0.25,67.06 90 top
R215  71.12,30.48 90 top
R216  31.75,67.06 90 top
R217  -14.48,67.06 90 top  (outside the outline)
R218  -10.92,67.06 90 top  (outside the outline)
R219  -7.37,67.06 90 top  (outside the outline)
R301  139.7,58.42 90 top
R302  276.86,118.11 0 top  (outside the outline)
R303  276.86,111.76 0 top  (outside the outline)
R304  276.86,149.86 0 top  (outside the outline)
T101  91.69,33.78 0 top
T102  88.9,116.84 0 top
T201  16.51,36.83 0 top
T202  16.51,30.48 0 top
X101  234.95,58.42 0 top  (outside the outline)
X102  90.17,76.2 0 top

### Tracks (layer width: path | path; a pad name or v marks a point on that pad's centre or on a via)
+12V  (3 unrouted)
DRAINS_NEG  (1 unrouted)
  Top 0.406: Q101.D 95.25,76.2 94.23,75.18 94.23,70.61 97.79,67.06 C111.2
DRAINS_POS  (1 unrouted)
  Top 0.406: Q102.D 85.09,76.2 86.11,77.22 86.11,81.91 C112.2
GBIAS  (5 unrouted)
GND  (55 unrouted)
IBIAS_SNS_A_NEG  (1 unrouted)
IBIAS_SNS_A_POS  (1 unrouted)
N1_NEG  (2 unrouted)
N1_POS  (1 unrouted)
  Top 0.406: R102.1 58.67,78.64 R104.1
N2A_NEG
  Top 0.406: C103.2 R103.2 118.62,73.76 R105.1
N2A_POS
  Top 0.406: C105.2 R104.2 61.72,78.64 R106.1
N3A_NEG
  Top 0.406: R113.1 108.08,77.07 L101.1 110.98,73.66 R111.1 111.01,73.66 C103.1 114.05,73.68 R108.2
N3A_POS
  Top 0.406: R114.1 72.26,75.33 L102.1 69.36,78.74 R112.1 69.33,78.74 C105.1 66.29,78.72 R110.2
N4A_NEG
  Top 0.406: Q101.G L101.2 | L101.2 105.79,77.07 R113.2 | R118.1 R117.1 105.79,70.49 L101.2
  Bottom 0.406: R115.1 97.17,73.68 Q101.G
N4A_POS
  Top 0.406: Q102.G L102.2 | L102.2 74.55,75.33 R114.2 | L102.2 74.55,81.91 R119.1 R120.1
  Bottom 0.406: R116.1 83.17,78.72 Q102.G
N5A_NEG  (1 unrouted)
  Top 0.813: Q101.S 99.05,78.74 R123.1 R121.1
N5A_POS  (1 unrouted)
  Top 0.813: Q102.S 81.29,73.66 R122.1 R124.1
N$1  (2 unrouted)
N$2  (3 unrouted)
N$3  (2 unrouted)
N$4
  Top 0.406: 102.87,68.58 R117.2 R118.2 101.98,64.13 C111.1
N$5
  Top 0.406: R111.2 C106.1
N$6  (2 unrouted)
N$7  (1 unrouted)
N$8
  Top 0.406: R110.1 66.29,69.61 C104.1 66.29,69.58 R109.2
N$9  (1 unrouted)
N$10
  Top 0.406: C107.1 R112.2
N$11
  Bottom 0.406: R116.2 C110.1
N$12
  Top 0.406: R119.2 R120.2 78.36,88.27 C112.1
N$13
  Top 0.406: R108.1 114.05,82.79 C102.1 114.05,82.82 R107.2
N$14  (4 unrouted)
N$15  (3 unrouted)
N$16  (2 unrouted)
N$17
  Bottom 0.406: R115.2 C109.1
N$18  (3 unrouted)
N$19  (3 unrouted)
N$20  (2 unrouted)
N$21  (5 unrouted)
N$23  (2 unrouted)
N$24  (1 unrouted)
N$25  (2 unrouted)
N$26  (2 unrouted)
N$27  (1 unrouted)
N$28  (1 unrouted)
N$29  (1 unrouted)
N$30  (1 unrouted)
N$31  (1 unrouted)
N$32  (1 unrouted)
N$33  (1 unrouted)
N$34  (1 unrouted)
N$37  (1 unrouted)
N$41  (1 unrouted)
N$43  (1 unrouted)
N$44  (2 unrouted)
N$45  (1 unrouted)
N$46  (4 unrouted)
N$47  (4 unrouted)
N$49  (1 unrouted)
VB  (2 unrouted)
VB_CT  (4 unrouted)
VB_CT1  (1 unrouted)